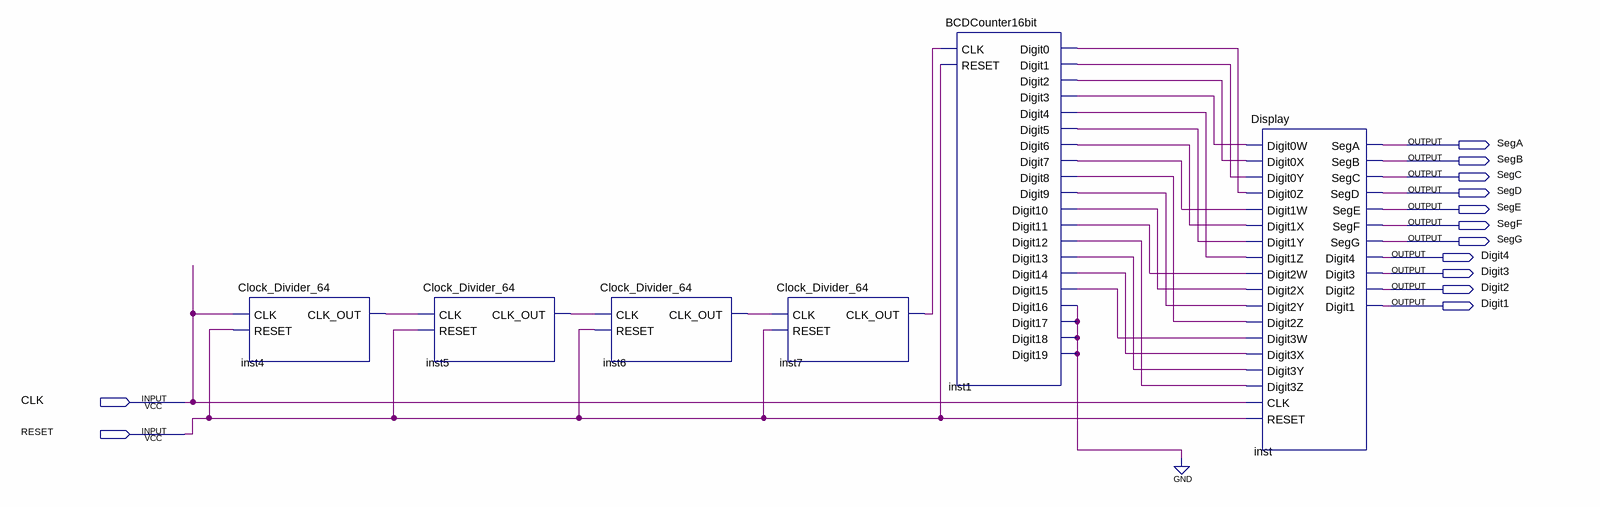
[diagram p0: schematic sheet]
// Quartus schematic displayCounter.bdf as structural Verilog: 6 symbols, 13 pins
module displayCounter (
  input  CLK,
  input  RESET,
  output SegA,
  output SegB,
  output SegC,
  output SegD,
  output SegE,
  output SegF,
  output SegG,
  output Digit4,
  output Digit3,
  output Digit2,
  output Digit1
);

  wire inst1_digit0, inst1_digit1, inst1_digit2, inst1_digit3, inst1_digit4, inst1_digit5, inst1_digit6,
       inst1_digit7, inst1_digit8, inst1_digit9, inst1_digit10, inst1_digit11, inst1_digit12, inst1_digit13,
       inst1_digit14, inst1_digit15, inst1_digit16, inst4_clk_out, inst5_clk_out, inst6_clk_out,
       inst7_clk_out;

  Clock_Divider_64 inst4 (.CLK(CLK), .RESET(RESET), .CLK_OUT(inst4_clk_out));
  Clock_Divider_64 inst5 (.CLK(inst4_clk_out), .RESET(RESET), .CLK_OUT(inst5_clk_out));
  Clock_Divider_64 inst6 (.CLK(inst5_clk_out), .RESET(RESET), .CLK_OUT(inst6_clk_out));
  Clock_Divider_64 inst7 (.CLK(inst6_clk_out), .RESET(RESET), .CLK_OUT(inst7_clk_out));
  BCDCounter16bit inst1 (
    .CLK(inst7_clk_out), .RESET(RESET), .Digit0(inst1_digit0), .Digit1(inst1_digit1), .Digit2(inst1_digit2),
    .Digit3(inst1_digit3), .Digit4(inst1_digit4), .Digit5(inst1_digit5), .Digit6(inst1_digit6),
    .Digit7(inst1_digit7), .Digit8(inst1_digit8), .Digit9(inst1_digit9), .Digit10(inst1_digit10),
    .Digit11(inst1_digit11), .Digit12(inst1_digit12), .Digit13(inst1_digit13), .Digit14(inst1_digit14),
    .Digit15(inst1_digit15), .Digit16(inst1_digit16), .Digit17(inst1_digit16), .Digit18(inst1_digit16),
    .Digit19(inst1_digit16));
  Display inst (
    .Digit0W(inst1_digit3), .Digit0X(inst1_digit2), .Digit0Y(inst1_digit1), .Digit0Z(inst1_digit0),
    .Digit1W(inst1_digit7), .Digit1X(inst1_digit6), .Digit1Y(inst1_digit5), .Digit1Z(inst1_digit4),
    .Digit2W(inst1_digit11), .Digit2X(inst1_digit10), .Digit2Y(inst1_digit9), .Digit2Z(inst1_digit8),
    .Digit3W(inst1_digit15), .Digit3X(inst1_digit14), .Digit3Y(inst1_digit13), .Digit3Z(inst1_digit12),
    .CLK(CLK), .RESET(RESET), .SegA(SegA), .SegB(SegB), .SegC(SegC), .SegD(SegD), .SegE(SegE), .SegF(SegF),
    .SegG(SegG), .Digit4(Digit4), .Digit3(Digit3), .Digit2(Digit2), .Digit1(Digit1));
  // also tied to GND on the sheet: inst1_digit16
endmodule
